# EAGLE design SNAC-PCEv3 (EAGLE 9.6.2)
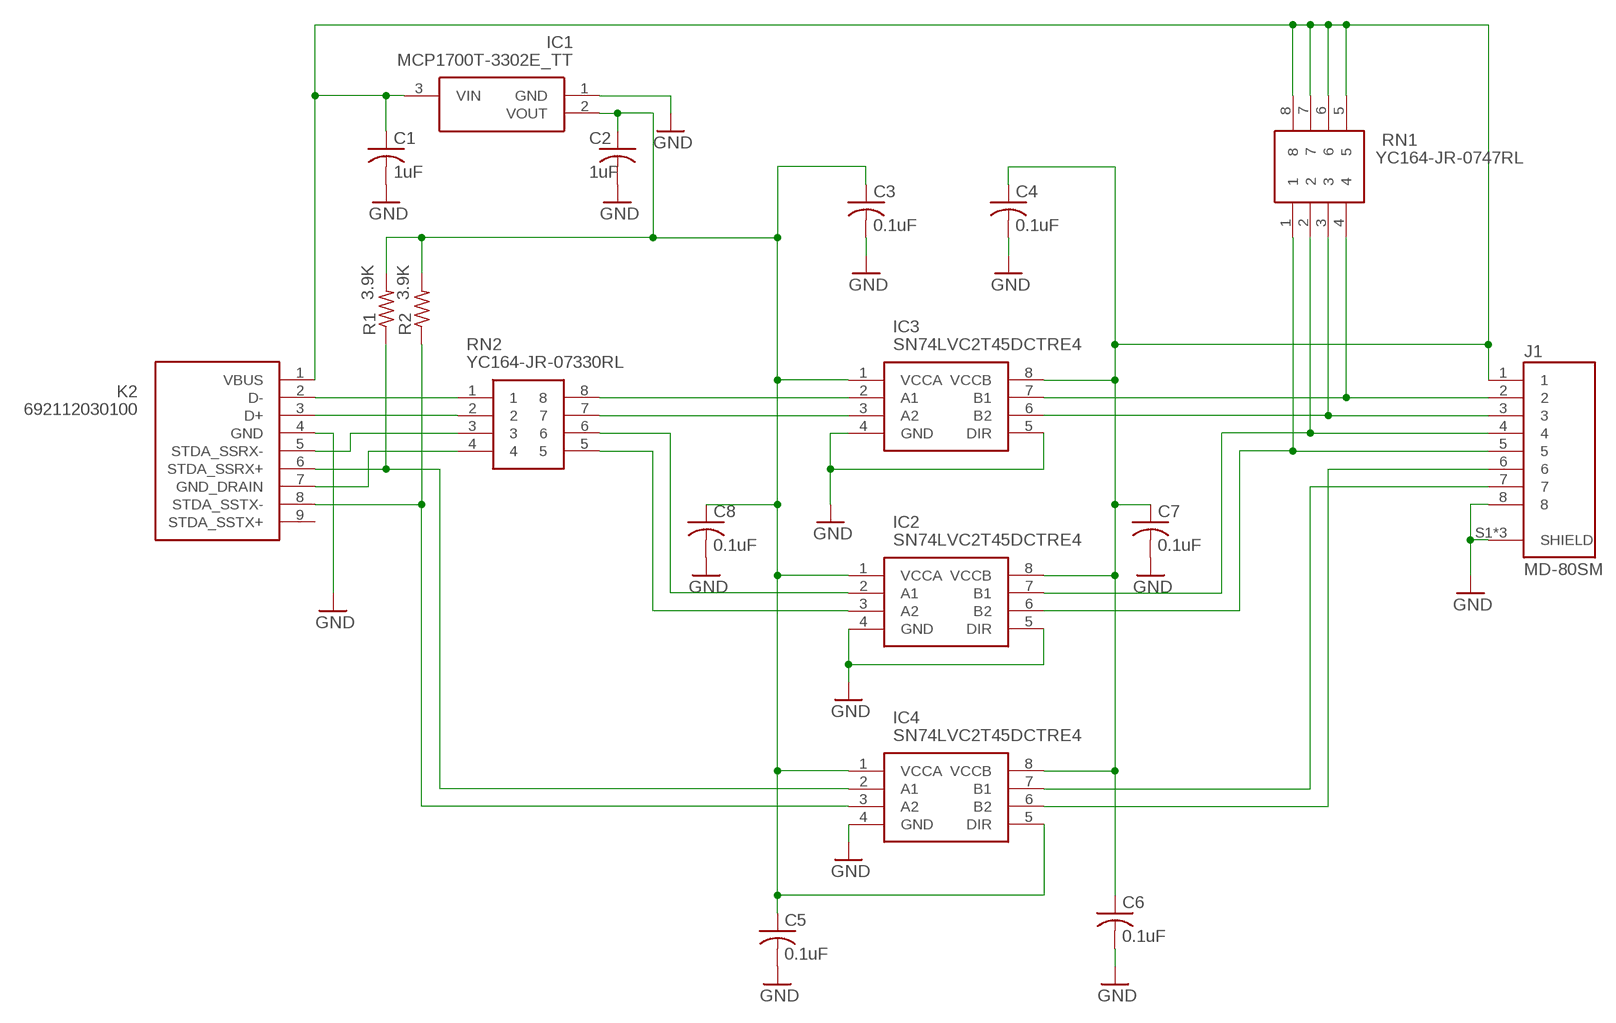
[diagram p0: schematic, sheet 1]

## Parts
C1  1uF  C-USC0603  [C0603]
C2  1uF  C-USC0603  [C0603]
C3  0.1uF  C-USC0402  [C0402]
C4  0.1uF  C-USC0402  [C0402]
C5  0.1uF  C-USC0402  [C0402]
C6  0.1uF  C-USC0402  [C0402]
C7  0.1uF  C-USC0402  [C0402]
C8  0.1uF  C-USC0402  [C0402]
IC1  MCP1700T-3302E_TT  [SOT95P237X112-3N]
IC2  SN74LVC2T45DCTRE4  [SOP65P400X130-8N]
IC3  SN74LVC2T45DCTRE4  [SOP65P400X130-8N]
IC4  SN74LVC2T45DCTRE4  [SOP65P400X130-8N]
J1  MD-80SM  [CUI_MD-80SM]
K2  692112030100  [692112030100]
R1  3.9K  R-US_R0402  [R0402]
R2  3.9K  R-US_R0402  [R0402]
RN1  YC164-JR-0747RL  YC164-JR-07330RL  [YC164JR07220RL]
RN2  YC164-JR-07330RL  [YC164JR07220RL]

## Nets
3V3: C2.1 C3.1 C5.1 C8.1 IC1.2(VOUT) IC2.1(VCCA) IC3.1(VCCA) IC4.1(VCCA) IC4.5(DIR) R1.2 R2.2
5V [power]: C1.1 C4.1 C6.1 C7.1 IC1.3(VIN) IC2.8(VCCB) IC3.8(VCCB) IC4.8(VCCB) J1.1 K2.1(VBUS) RN1.5 RN1.6 RN1.7 RN1.8
GND [power]: C1.2 C2.2 C3.2 C4.2 C5.2 C6.2 C7.2 C8.2 IC1.1(GND) IC2.4(GND) IC2.5(DIR) IC3.4(GND) IC3.5(DIR) IC4.4(GND) J1.8 J1.S1(SHIELD) J1.S2(SHIELD) J1.S3(SHIELD) K2.4(GND)
N$2: K2.2(D-) RN2.1
N$3: IC3.7(B1) J1.2 RN1.4
N$4: IC3.3(A2) RN2.7
N$5: IC2.7(B1) J1.4 RN1.2
N$6: IC3.2(A1) RN2.8
N$7: K2.3(D+) RN2.2
N$8: K2.5(STDA_SSRX-) RN2.3
N$9: IC4.7(B1) J1.7
N$10: IC3.6(B2) J1.3 RN1.3
N$11: IC2.6(B2) J1.5 RN1.1
N$12: IC4.6(B2) J1.6
N$13: IC2.2(A1) RN2.6
N$15: K2.7(GND_DRAIN) RN2.4
N$16: IC2.3(A2) RN2.5
RX+: IC4.2(A1) K2.6(STDA_SSRX+) R1.1
TX-: IC4.3(A2) K2.8(STDA_SSTX-) R2.1
Unconnected: K2.9(STDA_SSTX+)

## Library data of the parts
C1 C2 = rcl:C-US: CAPACITOR, American symbol; SPICEPREFIX: C
C3-C8 = resistor:C-US: CAPACITOR, American symbol
IC1 = PC-Engine:MCP1700T-3302E_TT: LDO voltage regulator 250mA Isupply 1uA Source: Datasheet <http://docs-emea.rs-online.com/webdocs/0dd1/0900766b80dd189b.pdf>; ARROW_PART_NUMBER: MCP1700T-3302E/TT; ARROW_PRICE-STOCK: https://www.arrow.com/en/products/mcp1700t-3302ett/microchip-technology; DESCRIPTION: LDO voltage regulator 250mA Isupply 1uA; HEIGHT: 1.12mm; MANUFACTURER_NAME: Microchip; MANUFACTURER_PART_NUMBER: MCP1700T-3302E/TT; MOUSER_PART_NUMBER: 579-MCP1700T3302E/TT; MOUSER_PRICE-STOCK: https://www.mouser.co.uk/ProductDetail/Microchip-Technology/MCP1700T-3302E-TT?qs=fM4xO01eazPmCNDrdHEdaw%3D%3D
IC2-IC4 = PC-Engine:SN74LVC2T45DCTRE4: Translation - Voltage Levels DUAL-BIT DUAL SUPPLY TRANSCEIVER Source: Datasheet <http://www.ti.com/lit/ds/symlink/sn74lvc2t45.pdf>; ARROW_PART_NUMBER: SN74LVC2T45DCTRE4; ARROW_PRICE-STOCK: https://www.arrow.com/en/products/sn74lvc2t45dctre4/texas-instruments; DESCRIPTION: Translation - Voltage Levels DUAL-BIT DUAL SUPPLY TRANSCEIVER; HEIGHT: 1.3mm; MANUFACTURER_NAME: Texas Instruments; MANUFACTURER_PART_NUMBER: SN74LVC2T45DCTRE4; MOUSER_PART_NUMBER: 595-SN74LVC2T45DCTE4; MOUSER_PRICE-STOCK: https://www.mouser.co.uk/ProductDetail/Texas-Instruments/SN74LVC2T45DCTRE4?qs=0smPjiIwnfKw%252BKTYvzl10g%3D%3D
J1 = MD-80SM-edit:MD-80SM: MD-XXSM Series 8 Pin Female Right Angle Shielded Side Mini DIN Connector; CUI_PURCHASE_URL: https://www.cui.com/product/interconnect/connectors/din-connectors/md-sm-series?utm_source=snapeda.com&utm_medium=referral&utm_campaign=snapedaBOM; DESCRIPTION: 3~9 Positions, Receptacle, Right Angle, Through Hole, Shielded, Mini Circular DIN Connector; DIGI-KEY_PART_NUMBER: CP-2280-ND; DIGI-KEY_PURCHASE_URL: https://www.digikey.com/product-detail/en/cui-inc/MD-80SM/CP-2280-ND/96944?utm_source=snapeda&utm_medium=aggregator&utm_campaign=symbol; MF: CUI Inc.; MP: MD-80SM; OC_NEWARK: unknown; PACKAGE: None
K2 = Wuerth_Elektronik_eiCan_Communication_Connectors_STENCIL:692112030100: WR-COM USB 3.0 SMT PLUG WITH CLIPTYPE A; MF: TEXAS INSTRUMENTS; MPN: TXS0108EPWR; OC_NEWARK: 73M7866
R1 R2 = resistor:R-US_: RESISTOR, American symbol
RN1 RN2 = SamacSys_Parts:YC164-JR-07330RL: YAGEO - YC164-JR-07330RL - RESISTOR ARRAY, ARV241 1206 330R Source: Datasheet <https://media.digikey.com/pdf/Data Sheets/Yageo PDFs/YC102-358,TC122-164_Series_DS.pdf>; DESCRIPTION: YAGEO - YC164-JR-07330RL - RESISTOR ARRAY, ARV241 1206 330R; HEIGHT: 0mm; MANUFACTURER_NAME: YAGEO (PHYCOMP); MANUFACTURER_PART_NUMBER: YC164-JR-07330RL; MOUSER_PART_NUMBER: 603-YC164-JR-07330RL; MOUSER_PRICE-STOCK: https://www.mouser.com/Search/Refine.aspx?Keyword=603-YC164-JR-07330RL

## Net classes
1 power: width 0.305 mm

## Board
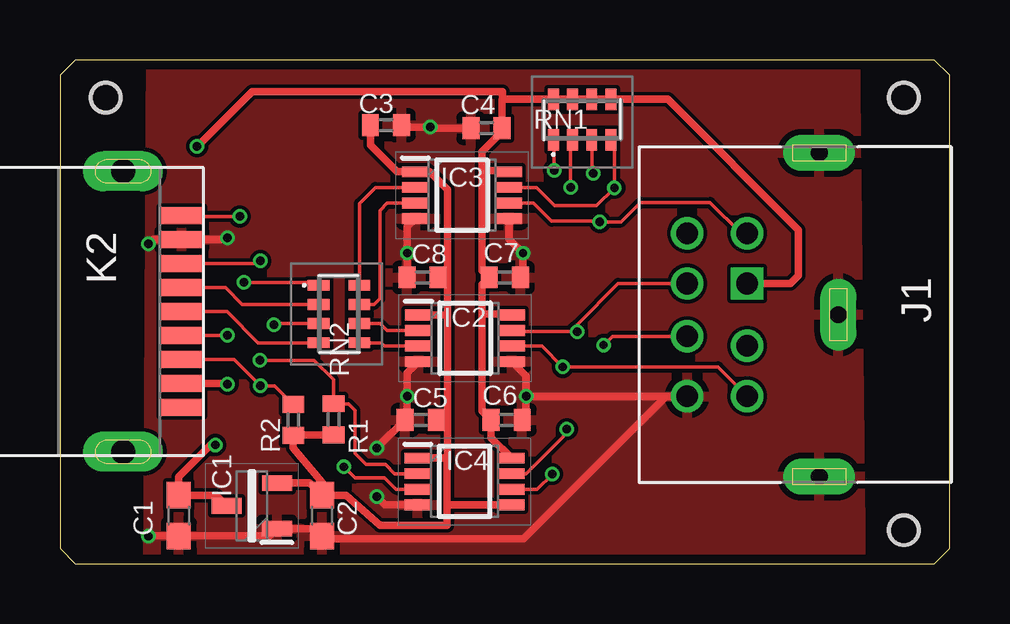
[diagram p1: board, top side]
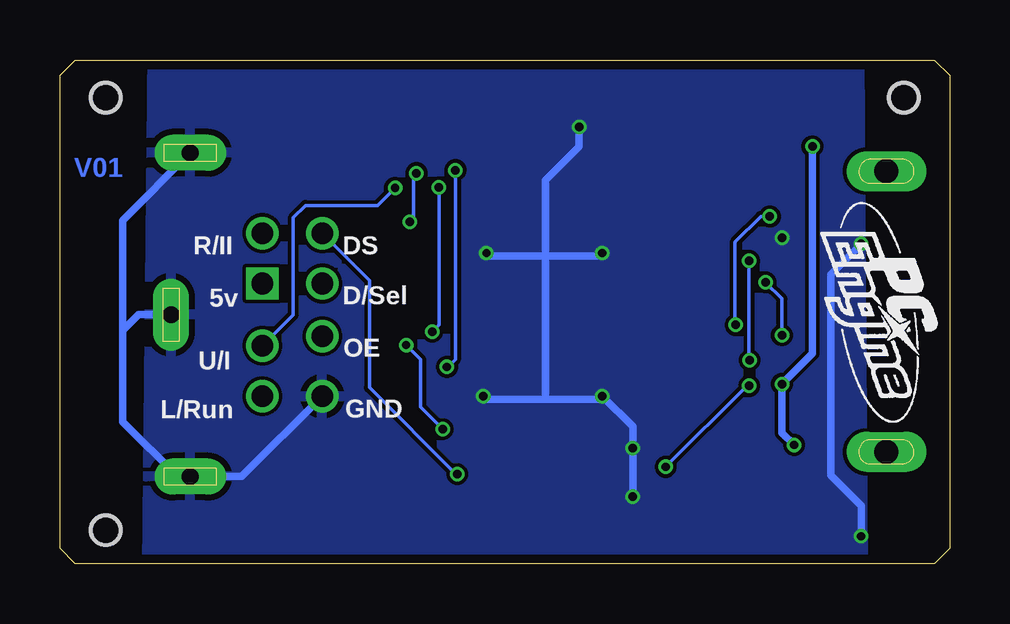
[diagram p2: board, bottom side, seen from below]

Size 37.08 x 21.01 mm. Coordinates in mm from the lower left corner, seen from the top.
Outline: 0.64,0 36.45,0 37.08,0.64 37.08,20.37 36.45,21.01 0.64,21.01 0,20.37 0,0.64 0.64,0
Copper layers (1*16): Top 0.035559375mm / dielectric 1.6mm / Bottom 0.035559375mm
Design rules "oshpark-2layer *": minimum track width 6mil, minimum drill 10mil, track to track 6mil, track to pad 6mil, pad to pad 6mil, via to via 6mil, smd to smd 6mil, copper to edge 15mil, drill to drill 6mil, minimum pad ring 5mil, minimum via ring 5mil, stop-mask expansion 2.5mil, vias tented up to drill 15mil, thermal gap 10mil
Holes 1.15 mm at 1.91,19.43 35.18,19.43 35.18,1.4
Holes 1.31 mm at 1.91,19.43 35.18,19.43 35.18,1.4 1.91,19.43 35.18,19.43 35.18,1.4

### Footprints (pad centres in the part's own frame; a part is rotated, then mirrored left to right if it is on the bottom)
C0603 = smd 1.1 x 1: 1 -0.85,0; 2 0.85,0
C0402 = smd 0.7 x 0.9: 1 -0.65,0; 2 0.65,0
SOT95P237X112-3N = smd 1.25 x 0.65: 1 -1.05,0.95; 2 -1.05,-0.95; 3 1.05,0
SOP65P400X130-8N = smd 1.1 x 0.45: 1 -1.95,0.975; 2 -1.95,0.325; 3 -1.95,-0.325; 4 -1.95,-0.975; 5 1.95,-0.975; 6 1.95,-0.325; 7 1.95,0.325; 8 1.95,0.975
CUI_MD-80SM = drill 0.9 square: 1 0,0 | drill 0.9: 2 2.6,0; 3 -2.1,0; 4 0,-2.5; 5 4.7,0; 6 -2.1,-2.5; 7 2.2,-2.5; 8 4.7,-2.5 | drill 0.7 pad 1.5 long: S1 -5.45,3; S2 8.05,3; S3 1.3,3.8
692112030100 = smd 0.7 x 1.8: 1 -3,0; 2 -1,0; 3 1,0; 4 3,0; 5 4,0; 6 2,0; 7 0,0; 8 -2,0; 9 -4,0 | drill 1 pad 1.676 long: Z1 5.85,2.45; Z2 -5.85,2.45
R0402 = smd 0.7 x 0.9: 1 -0.65,0; 2 0.65,0
YC164JR07220RL = smd 0.45 x 0.9: 1 -1.2,-0.85; 2 -0.4,-0.85; 3 0.4,-0.85; 4 1.2,-0.85; 5 1.2,0.85; 6 0.4,0.85; 7 -0.4,0.85; 8 -1.2,0.85

### Placement (x,y rotation side)
C1  4.95,2.01 270 top
C2  10.92,2.01 270 top
C3  13.59,18.29 0 top
C4  17.78,18.16 180 top
C5  15.04,5.99 180 top
C6  18.62,5.99 0 top
C7  18.54,11.94 0 top
C8  15.11,11.94 180 top
IC1  8,2.41 180 top
IC2  16.89,9.4 0 top
IC3  16.76,15.37 0 top
IC4  16.87,3.43 0 top
J1  28.65,11.68 270 top
K2  5.08,10.52 90 top
R1  11.4,6.02 270 top
R2  9.73,5.99 270 top
RN1  21.77,18.52 0 top
RN2  11.63,10.41 270 top

### Tracks (layer width: path | path; a pad name or v marks a point on that pad's centre or on a via)
3V3
  Top 0.305: C2.1 10.42,3.36 IC1.2 | 16.13,2.45 16.13,4.27 16.15,4.24 16.15,4.4 | 16.13,2.45 16.13,1.6 13.33,1.6 11.92,2.86 C2.1 | 16.15,4.4 IC4.1 | IC4.5 16.13,2.45 | C2.1 10.92,3.39 9.73,4.82 R2.2 9.75,5.37 R1.2 | 16.15,4.4 16.15,6.1 | 16.15,6.1 16.15,10.41 | 16.15,10.41 16.15,11.94 | 16.15,11.94 16.15,15.6 15.41,16.34 IC3.1 14.05,16.34 12.94,17.45 C3.1 | 16.15,11.94 C8.1 | 16.15,10.41 16.11,10.37 IC2.1 | 16.15,6.1 16.05,5.99 C5.1
5V  (via drill 0.35)
  Top 0.305: K2.1 6.96,7.52 v6.99,7.49 | v6.48,4.95 6.29,4.95 4.95,3.62 C1.1 6.51,2.86 IC1.3 | J1.1 30.45,11.68 30.79,12.01 30.79,13.92 25.34,19.37 RN1.5 RN1.6 RN1.7 RN1.8 18.45,19.37 | v5.71,17.4 8,19.68 18.45,19.68 18.45,19.37 | IC4.8 17.97,5.25 C6.1 17.6,6.36 17.6,10.41 | 17.6,16.38 17.6,17.18 18.45,18.03 18.45,18.14 C4.1 18.43,19.34 18.45,19.37 | 17.6,16.38 18.67,16.38 IC3.8 | 17.6,10.41 18.8,10.41 IC2.8 | 17.6,10.41 17.6,11.65 C7.1 17.6,12.23 17.6,16.38
  Bottom 0.305: v5.71,17.4 5.71,8.76 v6.99,7.49 6.99,5.46 v6.48,4.95
GND  (via drill 0.35)
  Top 0.305: v6.99,13.59 6.91,13.52 K2.4 3.86,13.52 v3.68,13.34 | v3.68,1.14 3.7,1.16 C1.2 8.74,1.16 IC1.1 10.87,1.46 C2.2 11.07,1.04 19.32,1.04 25.26,6.98 J1.8 v19.43,6.99 | v13.21,2.79 13.55,2.45 IC4.4 | v13.21,4.83 14.38,5.99 C5.2 14.48,6.09 v14.48,6.99 14.48,7.96 IC2.4 | C4.2 15.49,18.16 v15.44,18.21 14.31,18.21 C3.2 | v19.43,6.99 19.43,7.83 IC2.5 | v19.43,6.99 19.43,6.16 C6.2 | C8.2 14.48,11.95 v14.48,12.95 14.48,14.06 IC3.4 | C7.2 19.3,12.05 v19.3,12.95 18.71,13.54 IC3.5
  Bottom 0.305: J1.S1 34.47,14.32 34.47,9.73 | 34.47,9.73 34.47,5.92 32.18,3.63 J1.S2 29.5,3.63 J1.8 | J1.S3 33.81,10.38 34.47,9.73 | v3.68,13.34 4.95,12.06 4.95,3.68 3.68,2.41 v3.68,1.14 | 16.84,6.86 16.84,12.83 | 16.84,12.83 16.84,16 15.44,17.4 v15.44,18.21 | v13.21,2.79 v13.21,4.83 13.21,5.71 v14.48,6.99 14.61,6.86 16.84,6.86 | 16.84,12.83 14.61,12.83 v14.48,12.95 | 16.84,12.83 19.18,12.83 v19.3,12.95 | 16.84,6.86 19.3,6.86 v19.43,6.99
  pour Bottom: 3.73,21.33 33.23,21.39 33.48,-0.18 3.59,-0.42
  pour Top: 3.67,-0.68 3.81,21.54 33.13,21.51 33.38,-0.41
N$2  (via drill 0.35)
  Top 0.152: K2.2 6.98,9.52 v6.99,9.53 | RN2.1 10.66,11.73 v7.67,11.73
  Bottom 0.152: v7.67,11.73 6.99,11.05 v6.99,9.53
N$3  (via drill 0.35)
  Top 0.152: RN1.4 23.11,17.52 v23.11,15.67 22.37,14.93 20.62,14.93 19.86,15.69 IC3.7
  Bottom 0.152: v23.11,15.67 23.85,14.94 26.85,14.94 27.36,14.43 27.36,10.38 J1.2
N$4
  Top 0.152: RN2.7 13.1,10.81 13.34,11.05 13.34,14.73 13.64,15.04 IC3.3
N$5  (via drill 0.35)
  Top 0.152: J1.4 23.27,11.68 21.57,9.98 v21.57,9.68 18.89,9.68 IC2.7 | RN1.2 21.29,17.58 v21.29,15.7
  Bottom 0.152: v21.29,15.7 21.29,9.96 v21.57,9.68
N$6
  Top 0.152: RN2.8 12.48,15.02 13.15,15.69 IC3.2
N$7
  Top 0.152: RN2.2 7.6,10.81 6.9,11.52 K2.3
N$8  (via drill 0.35)
  Top 0.152: RN2.3 8.97,10.01 v8.91,9.96 | v7.49,14.48 5.12,14.48 K2.5
  Bottom 0.152: v7.49,14.48 7.87,14.48 8.94,13.41 8.94,9.98 v8.91,9.96
N$9  (via drill 0.35)
  Top 0.152: J1.7 23.02,9.48 v22.66,9.12 | IC4.7 19.43,3.75 21.13,5.46 v21.13,5.61
  Bottom 0.152: v21.13,5.61 22.05,6.53 22.05,8.51 v22.66,9.12
N$10  (via drill 0.35)
  Top 0.152: J1.3 28.38,13.78 27.1,15.06 24.21,15.06 23.39,14.25 v22.5,14.25 22.47,14.28 20.49,14.28 19.73,15.04 IC3.6 | v22.23,16.28 22.17,16.34 RN1.3
  Bottom 0.152: v22.23,16.28 22.35,16.15 22.35,14.25 v22.5,14.25
N$11  (via drill 0.35)
  Top 0.152: J1.5 27.43,8.2 v20.95,8.2 20.09,9.07 IC2.6 | RN1.1 20.6,17.64 v20.6,16.41
  Bottom 0.152: v20.6,16.41 20.6,8.51 20.9,8.2 v20.95,8.2
N$12  (via drill 0.35)
  Top 0.152: v20.52,3.73 19.89,3.1 IC4.6
  Bottom 0.152: J1.6 24.18,11.81 24.18,7.34 20.57,3.73 v20.52,3.73
N$13
  Top 0.152: RN2.6 13.35,10.01 13.64,9.72 IC2.2
N$15
  Top 0.152: K2.7 6.96,10.52 8.26,9.21 RN2.4
N$16
  Top 0.152: RN2.5 13.39,9.21 13.53,9.07 IC2.3
RX+  (via drill 0.35)
  Top 0.152: K2.6 8.25,12.52 v8.36,12.62 | v8.33,8.48 10.6,8.48 11.4,7.68 R1.1 12.03,6.67 12.29,6.4 12.29,4.6 12.76,4.13 13.57,4.13 13.95,3.75 IC4.2
  Bottom 0.152: v8.33,8.48 8.36,8.51 v8.36,12.62
TX-  (via drill 0.35)
  Top 0.152: K2.8 7.26,8.52 v8.36,7.42 8.96,7.42 R2.1 | v11.84,4.04 12.3,3.58 13.53,3.58 14,3.1 IC4.3
  Bottom 0.152: v8.36,7.42 8.46,7.42 v11.84,4.04

### Text on the board
Bottom: V01
bPlace: DS | R/II | D/Sel | 5v | OE | U/I | GND | L/Run